# Altium schematic sheet #NIP涡轮驱动板-2.SchDoc
size A3
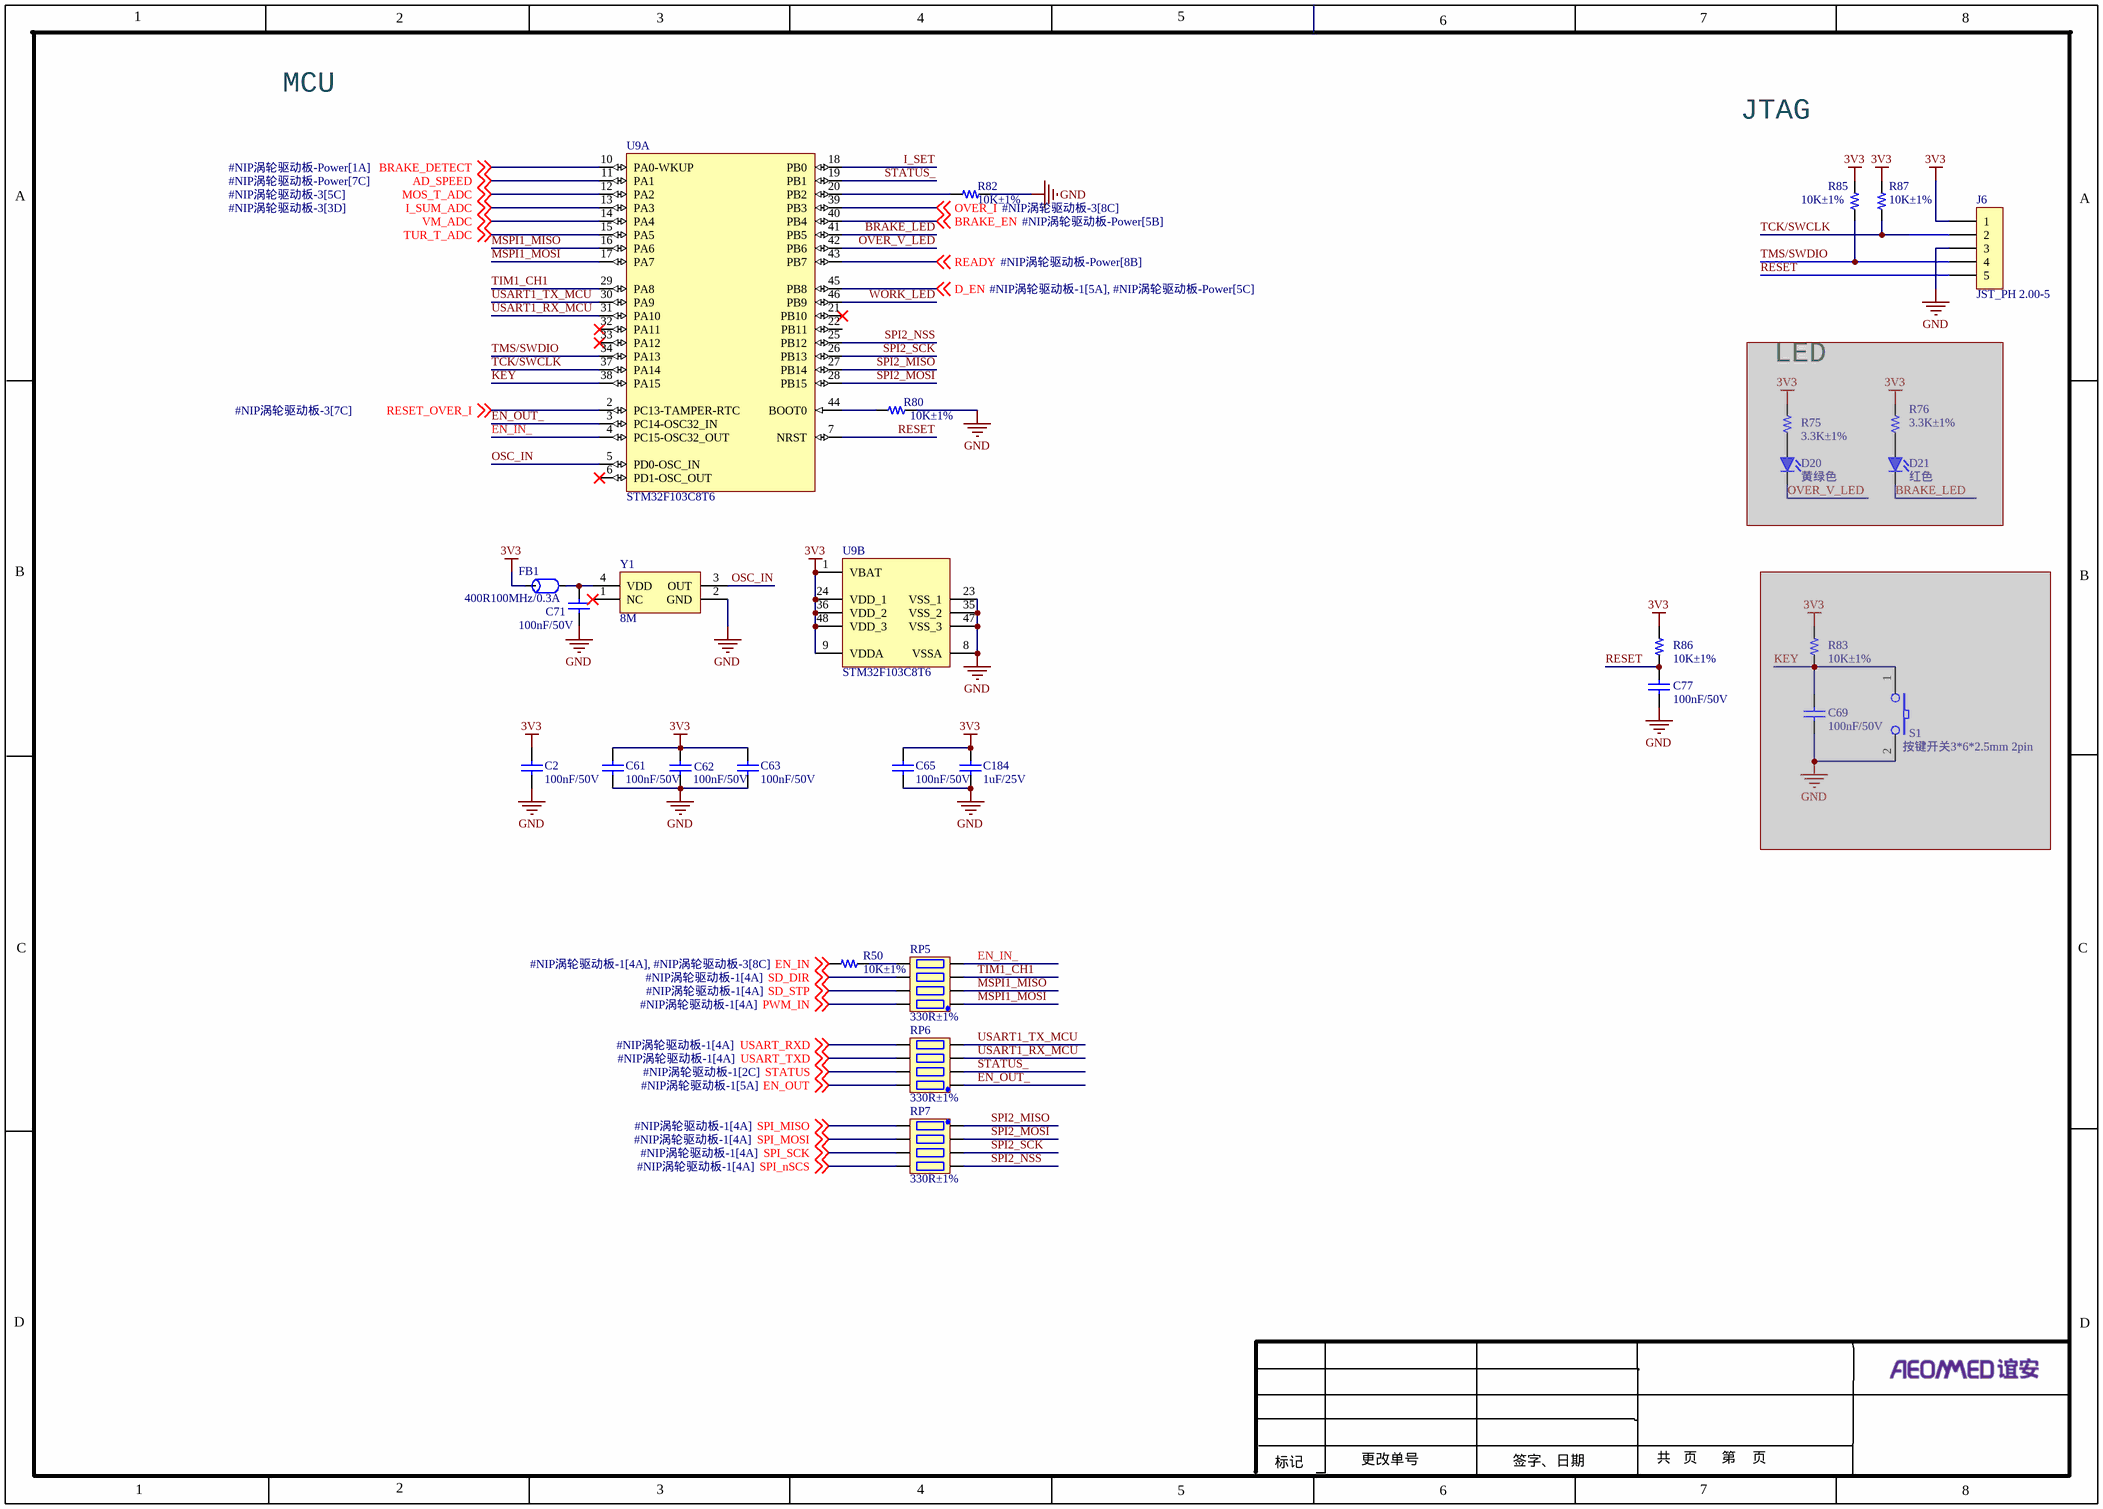
[diagram p0: #NIP涡轮驱动板-2.SchDoc]

## Parts
C2  100nF/50V  [C0402]
C61  100nF/50V  [C0402]
C62  100nF/50V  [C0402]
C63  100nF/50V  [C0402]
C65  100nF/50V  [C0402]
C69  100nF/50V  [C0402]  (masked out: inside a compile mask, not in the netlist)
C71  100nF/50V  [C-0603]
C77  100nF/50V  [C0402]
C184  1uF/25V  [C-0603]
D20  黄绿色  [LED-0805]  (masked out: inside a compile mask, not in the netlist)
D21  红色  [LED-0805]  (masked out: inside a compile mask, not in the netlist)
FB1  400R100MHz/0.3A  [FB-0805]
J6  JST_PH 2.00-5  [JST_PH 2.00-5]
R50  10K±1%  [R0402]
R75  3.3K±1%  [R-0603]  (masked out: inside a compile mask, not in the netlist)
R76  3.3K±1%  [R-0603]  (masked out: inside a compile mask, not in the netlist)
R80  10K±1%  [R0402]
R82  10K±1%  [R0402]
R83  10K±1%  [R0402]  (masked out: inside a compile mask, not in the netlist)
R85  10K±1%  [R0402]
R86  10K±1%  [R0402]
R87  10K±1%  [R0402]
RP5  330R±1%  [RES-ARRAY-SMD_0402-8P-L2.0-W1.0-BL]
RP6  330R±1%  [RES-ARRAY-SMD_0402-8P-L2.0-W1.0-BL]
RP7  330R±1%  [RES-ARRAY-SMD_0402-8P-L2.0-W1.0-BL]
S1  按键开关3*6*2.5mm 2pin  [SW-SMD_L4.0-W3.0-LS5.0]  (masked out: inside a compile mask, not in the netlist)
U9  STM32F103C8T6  [STM-LQFP48_N]  (parts A,B of 2)
Y1  8M  [Y-X32F_JFVNY]

## Nets
3V3: C2.1 C61.1 C62.2 C63.2 C65.1 C184.1 FB1.1 J6.1 R85.2 R86.2 R87.2 U9.1(VBAT) U9.9(VDDA) U9.24(VDD_1) U9.36(VDD_2) U9.48(VDD_3)
GND: C2.2 C61.2 C62.1 C63.1 C65.2 C71.2 C77.1 C184.2 J6.3 R80.2 R82.2 U9.8(VSSA) U9.23(VSS_1) U9.35(VSS_2) U9.47(VSS_3) Y1.2(GND)
AD_SPEED: U9.11(PA1) ; off-sheet AD_SPEED
BRAKE_DETECT: U9.10(PA0-WKUP) ; off-sheet BRAKE_DETECT
BRAKE_EN: U9.40(PB4) ; off-sheet BRAKE_EN
BRAKE_LED: U9.41(PB5)
D_EN: U9.45(PB8) ; off-sheet D_EN
EN_IN: R50.1 ; off-sheet EN_IN
EN_IN_: RP5.4 U9.4(PC15-OSC32_OUT)
EN_OUT: RP6.8 ; off-sheet EN_OUT
EN_OUT_: RP6.1 U9.3(PC14-OSC32_IN)
I_SET: U9.18(PB0)
I_SUM_ADC: U9.13(PA3) ; off-sheet I_SUM_ADC
KEY: U9.38(PA15)
MOS_T_ADC: U9.12(PA2) ; off-sheet MOS_T_ADC
MSPI1_MISO: RP5.2 U9.16(PA6)
MSPI1_MOSI: RP5.1 U9.17(PA7)
OSC_IN: U9.5(PD0-OSC_IN) Y1.3(OUT)
OVER_I: U9.39(PB3) ; off-sheet OVER_I
OVER_V_LED: U9.42(PB6)
PWM_IN: RP5.8 ; off-sheet PWM_IN
READY: U9.43(PB7) ; off-sheet READY
RESET: C77.2 J6.5 R86.1 U9.7(NRST)
RESET_OVER_I: U9.2(PC13-TAMPER-RTC) ; off-sheet RESET_OVER_I
SD_DIR: RP5.6 ; off-sheet SD_DIR
SD_STP: RP5.7 ; off-sheet SD_STP
SPI2_MISO: RP7.1 U9.27(PB14)
SPI2_MOSI: RP7.2 U9.28(PB15)
SPI2_NSS: RP7.4 U9.25(PB12)
SPI2_SCK: RP7.3 U9.26(PB13)
SPI_MISO: RP7.8 ; off-sheet SPI_MISO
SPI_MOSI: RP7.7 ; off-sheet SPI_MOSI
SPI_nSCS: RP7.5 ; off-sheet SPI_nSCS
SPI_SCK: RP7.6 ; off-sheet SPI_SCK
STATUS: RP6.7 ; off-sheet STATUS
STATUS_: RP6.2 U9.19(PB1)
TCK/SWCLK: J6.2 R87.1 U9.37(PA14)
TIM1_CH1: RP5.3 U9.29(PA8)
TMS/SWDIO: J6.4 R85.1 U9.34(PA13)
TUR_T_ADC: U9.15(PA5) ; off-sheet TUR_T_ADC
USART1_RX_MCU: RP6.3 U9.31(PA10)
USART1_TX_MCU: RP6.4 U9.30(PA9)
USART_RXD: RP6.5 ; off-sheet USART_RXD
USART_TXD: RP6.6 ; off-sheet USART_TXD
VM_ADC: U9.14(PA4) ; off-sheet VM_ADC
WORK_LED: U9.46(PB9)
NetC71_1: C71.1 FB1.2 Y1.4(VDD)
NetR50_2: R50.2 RP5.5
NetR80_1: R80.1 U9.44(BOOT0)
NetR82_1: R82.1 U9.20(PB2)

Not connected (* = marked no-connect by the designer): U9 6(PD1-OSC_OUT)* 21(PB10)* 22(PB11) 32(PA11)* 33(PA12)*; Y1 1(NC)*

## Notes on the sheet
- MCU
- JTAG
- (near R75) LED
- 1
- 2
- 3
- 4
- 5
- 6
- 7
- 8
- A
- B
- C
- D
- 更改单号
- 共   页      第    页
- 标记
- 签字、日期

## Library data of the parts
C2 C61-C63 C65 C69 C71 C77 = C-0603: 物料编号: *; 物料名称: *; 厂家: *; 详细描述: *
C184 = C-0805
D20 = LED-0805: 品牌:Everlight（亿光），型号17-21SYGC/S530-E2/TR8，Typ.23mcd@20mA，ROHS
D21 = LED-0805: 品牌:Everlight（亿光），型号:17-21SURC/S530-A3/TR8，Typ.61mcd@20mA, ROHS
FB1 = FB-0805: Rdc0.3Ω,伍尔特,742792032
J6 = JST_PH 2.00-5: 品牌：JST 型号：B5B-PH-K-S，直插，间距2.00，5pin; 名称: 插座2针，2.0间距; 制造商: JST; 物料编号: B5B-PH-K-S
R50 R75 R76 R80 R82 R83 R85-R87 = R-0603
RP5-RP7 = RP-0603
S1 = 按键开关3*6*2.5mm 2pin: 厂家: 欧姆龙; 物料名称: 按键; 详细描述: 按键开关3*6*2.5mm 2pin，ROHS; 物料编号: *
U9 = STM32F103C8T6: ARM Cortex-M3 32-bit MCU, 64 KB Flash, 20 KB Internal RAM, 37 I/Os, 48-pin LQFP, -40 to 85 degC, Tray; A/D Converter: 2x12-bit (10 Channel); FLASH Size (Prog) (kB): 64; I/Os (High Current): 37; Internal RAM Size (kB): 20; Operating Frequency(F) (Processor speed) (MHz): 72; Supply Voltage(Vcc) min (V): 2; DatasheetVersion: Rev. 16; PackageVersion: Rev. 6, 06/2013; PackageReference: LQFP48; PackageDescription: 48-Pin Low Profile Quad Flat Package, 7 x 7 mm Body, 0.5 mm Pitch; Supplier 1: Digi-Key; Supplier Part Number 1: 497-6063-ND; Supplier 2: Farnell; Supplier Part Number 2: 1447637; Supplier 3: Newark; Supplier Part Number 3: 59M2182; Supplier 4: Newark; Supplier Part Number 4: 57P1222; Supplier 5: Mouser; Supplier Part Number 5: 511-STM32F103C8T6; Core: ARM Cortex-M3; Packing: Tray; Mounting Technology: Surface Mount; PartNumber: STM32F103C8T6; ComponentLink1Description: Manufacturer URL; ComponentLink1URL: http://www.st.com/web/en/home.html; ComponentLink2Description: Datasheet; ComponentLink2URL: http://www.st.com/st-web-ui/static/active/en/resource/technical/document/datasheet/CD00161566.pdf; ComponentLink3Description: Package Specification; ComponentLink3URL: http://www.st.com/st-web-ui/static/active/en/resource/technical/document/datasheet/DM00058181.pdf
Y1 = Y-X32F_JFVNY: 品牌：TAITIEN,型号：（OX系列）OXETELJANF-8.000000，尺寸：3.2 x 2.5mm; 制造商: TAITIEN